# Altium schematic sheet ID-Serial.SchDoc
size A3; DocumentNumber: 10; SheetNumber: 10; SheetTotal: 10; PageSetup: Record=PageOptions|CenterHorizontal=True|CenterVertical=True|PrintScale=0.97|XCorrection=1.00|YCorrection=1.00|PrintKind=1|BorderSize=5000000|LeftOffset=0|BottomOffset=0|Orientation=2|PaperLength=2970|PaperWidth=2100|Scale=100|PaperSource=7|PrintQuality=600|MediaType=1|DitherType=10|PaperKind=A4|PrintScaleMode=1
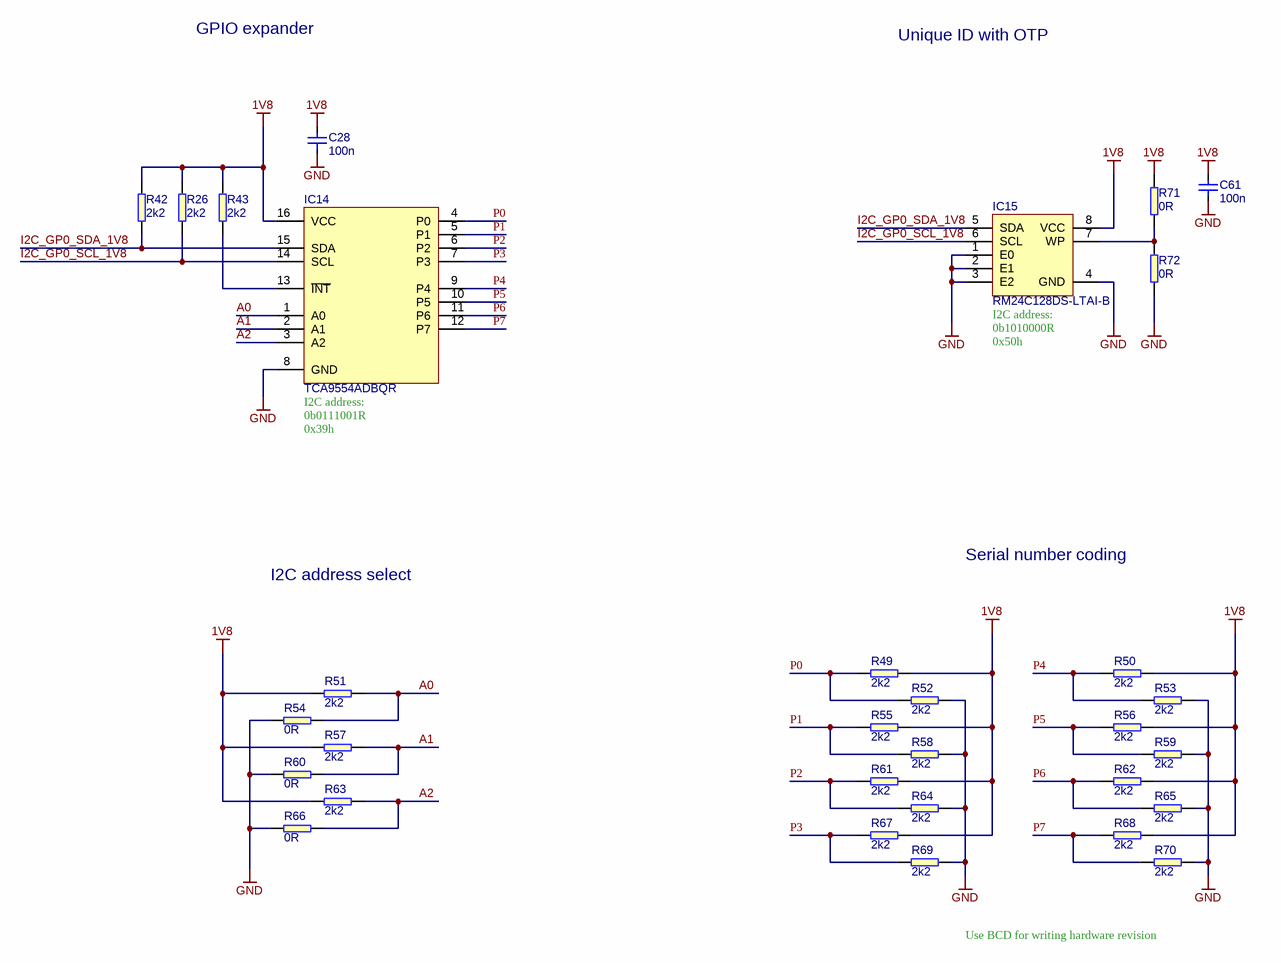
[diagram p0: ID-Serial.SchDoc]

## Parts
C28  100n  [0603]
C61  100n  [0603]
IC14  TCA9554ADBQR  [DBQ0016A]
IC15  RM24C128DS-LTAI-B  [TSSOP-8]
R26  2k2  [0603]
R42  2k2  [0603]
R43  2k2  [0603]
R49  2k2  [0402]
R50  2k2  [0402]
R51  2k2  [0402]
R52  2k2  [0402]
R53  2k2  [0402]
R54  0R  [0402]
R55  2k2  [0402]
R56  2k2  [0402]
R57  2k2  [0402]
R58  2k2  [0402]
R59  2k2  [0402]
R60  0R  [0402]
R61  2k2  [0402]
R62  2k2  [0402]
R63  2k2  [0402]
R64  2k2  [0402]
R65  2k2  [0402]
R66  0R  [0402]
R67  2k2  [0402]
R68  2k2  [0402]
R69  2k2  [0402]
R70  2k2  [0402]
R71  0R  [0603]
R72  0R  [0603]

## Nets
1V8: C28.2 C61.2 IC14.16(VCC) IC15.8(VCC) R26.2 R42.2 R43.2 R49.2 R50.2 R51.1 R55.2 R56.2 R57.1 R61.2 R62.2 R63.1 R67.2 R68.2 R71.2
GND: C28.1 C61.1 IC14.8(GND) IC15.1(E0) IC15.2(E1) IC15.3(E2) IC15.4(GND) R52.2 R53.2 R54.1 R58.2 R59.2 R60.1 R64.2 R65.2 R66.1 R69.2 R70.2 R72.1
A0: IC14.1(A0) R51.2 R54.2
A1: IC14.2(A1) R57.2 R60.2
A2: IC14.3(A2) R63.2 R66.2
I2C_GP0_SCL_1V8: IC14.14(SCL) IC15.6(SCL) R26.1
I2C_GP0_SDA_1V8: IC14.15(SDA) IC15.5(SDA) R42.1
P0: IC14.4(P0) R49.1 R52.1
P1: IC14.5(P1) R55.1 R58.1
P2: IC14.6(P2) R61.1 R64.1
P3: IC14.7(P3) R67.1 R69.1
P4: IC14.9(P4) R50.1 R53.1
P5: IC14.10(P5) R56.1 R59.1
P6: IC14.11(P6) R62.1 R65.1
P7: IC14.12(P7) R68.1 R70.1
NetIC14_13: IC14.13(~{INT}) R43.1
NetIC15_7: IC15.7(WP) R71.1 R72.2

## Notes on the sheet
- GPIO expander
- Unique ID with OTP
- (near IC15) 0b1010000R
- 0x50h
- (near IC15) I2C address:
- (near IC14) 0b0111001R
- 0x39h
- (near IC14) I2C address:
- Serial number coding
- I2C address select
- Use BCD for writing hardware revision
- Title:
- Size:
- Date:
- A3
- Revision:
- Page:
- of
- Antmicro Ltd.
- File:
- www.antmicro.com

## Library data of the parts
C28 C61 = C_100n_0603: MLCC SMT Capacitor 100nF 0603; Manufacturer: WALSIN; Part Symbol: 0603B104K500CT; Part Number: C_100n_0603; Value: 100n
IC14 = TCA9554A: Remote 8bit I2C SMBus I/O expander; Manufacturer: Texas Instruments; Part Number: TCA9554ADBQR; Value: TCA9554ADBQR; Part Symbol: TCA9554ADBQR
IC15 = RM24C128DS: EEPROM with UID and OTP registers.; Manufacturer: Adesto; Part Number: RM24C128DS; Value: RM24C128DS-LTAI-B; Part Symbol: RM24C128DS-LTAI-B
R26 R42 R43 = R_2k2_0603: SMT Resistor 2k2 0603; Manufacturer: MULTICOMP; Part Symbol: MCMR06X2201FTL; Part Number: R_2k2_0603; Value: 2k2
R49-R53 R55-R59 R61-R65 R67-R70 = R_2k2_0402: RES, 2k2, 0402, 5%; Manufacturer: MULTICOMP; Part Symbol: MCWR04X2201FTL; Part Number: R_2k2_0402; Value: 2k2
R54 R60 R66 = R_0R_0402: SMT Resistor 0402; Manufacturer: MULTICOMP; Part Symbol: MCMR04X000 PTL; Part Number: R_0R_0402; Value: 0R
R71 R72 = R_0R_0603: SMT Resistor 0R 0603; Manufacturer: BOURNS; Part Symbol: CR0603-J/-000ELF; Part Number: R_0R_0603; Value: 0R